# EAGLE schematic MuxTVI (EAGLE 7.6.0)
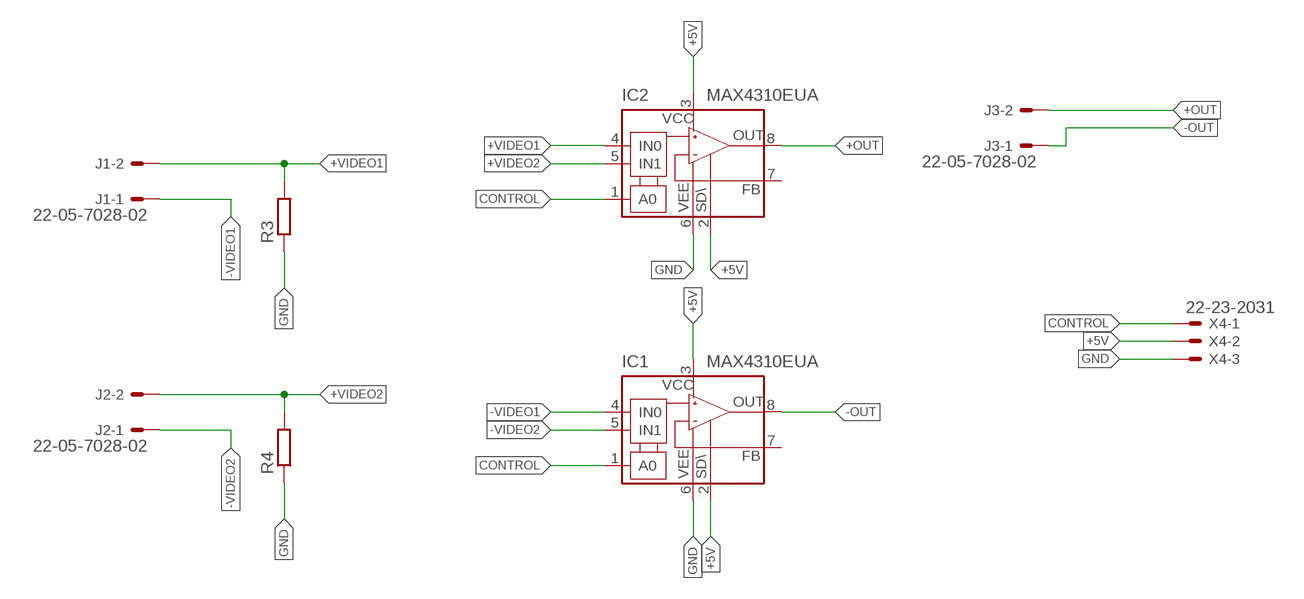
[diagram p0: schematic, sheet 1]

## Parts
IC1  MAX4310EUA  [SO08]
IC2  MAX4310EUA  [SO08]
J1  22-05-7028-02  [7395-02]
J2  22-05-7028-02  [7395-02]
J3  22-05-7028-02  [7395-02]
R3  R-EU_R1206  [R1206]
R4  R-EU_R1206  [R1206]
X4  22-23-2031  [22-23-2031]

## Nets
+5V: IC1.2(!SHDN) IC1.3(V+) IC2.2(!SHDN) IC2.3(V+) X4.2
+OUT: IC2.8(OUT) J3.2
+VIDEO1: IC2.4(IN0) J1.2 R3.2
+VIDEO2: IC2.5(IN1) J2.2 R4.2
-OUT: IC1.8(OUT) J3.1
-VIDEO1: IC1.4(IN0) J1.1
-VIDEO2: IC1.5(IN1) J2.1
CONTROL: IC1.1(A0) IC2.1(A0) X4.1
GND: IC1.6(V-) IC2.6(V-) R3.1 R4.1 X4.3

## Power pins joined to a net without a drawn wire
FB: IC1.7(FB) IC2.7(FB)

## Library data of the parts
IC1 IC2 = maxim:MAX4310: Video Multiplexer-Amplifier High-Speed, Low-Power, Single-Supply, Multichannel; OC_FARNELL: unknown; OC_NEWARK: unknown
J1-J3 = con-molex:22-?-02: CONNECTOR wire to board 2.54 mm (.1 inch) pitch header; OC_FARNELL: 9731601; OC_NEWARK: unknown
R3 R4 = rcl:R-EU_: RESISTOR, European symbol
X4 = con-molex:22-23-2031: .100" (2.54mm) Center Header - 3 Pin; MF: MOLEX; MPN: 22-23-2031; OC_FARNELL: 1462950; OC_NEWARK: 30C0862